# EAGLE design Wrist (EAGLE 9.5.2)
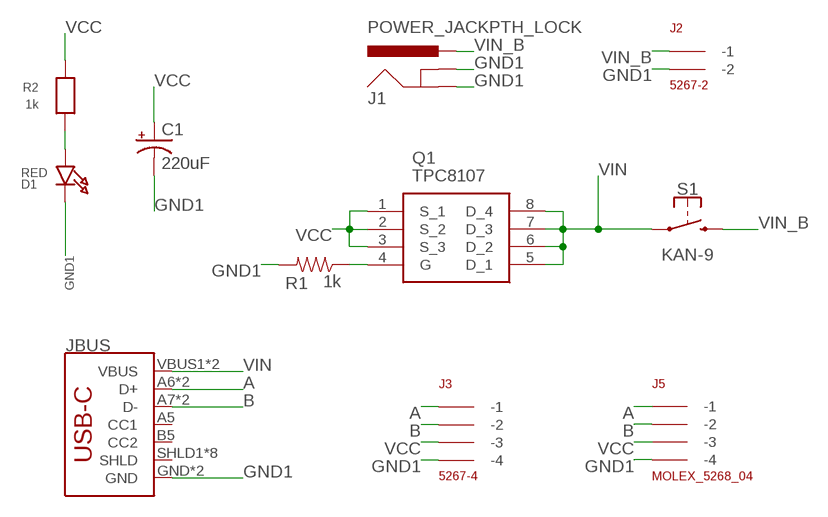
[diagram p0: schematic, sheet 1]

## Parts
C1  220uF  100UF-POLAR-25V-20%(ELEC)  [PANASONIC_D]
D1  RED  LED0603  [CHIPLED_0603]
J1  POWER_JACKPTH_LOCK  [POWER_JACK_PTH_LOCK]
J2  5267-2  [5267-2]
J3  5267-4  [5267-4]
J5  MOLEX_5268_04  [5267-4]
JBUS  USB_C16PIN  [USB-C-16P]
Q1  TPC8107  [SOIC127P600X175-8N]
R1  1k  1KOHM-0603-1/10W-1%  [0603]
R2  1k  RESISTOR0603MINI  [0603-MINI]
S1  KAN-9  [KAN-9]

## Nets
A: J3.P$1(-1) J5.P$1(-1) JBUS.A6(D+) JBUS.B6(D+)
B: J3.P$2(-2) J5.P$2(-2) JBUS.A7(D-) JBUS.B7(D-)
GND1 [POWER]: C1.- D1.C J1.GND J1.GNDBREAK J2.P$2(-2) J3.P$4(-4) J5.P$4(-4) JBUS.GND JBUS.GND2(GND) R1.2
N$6: D1.A R2.1
N$7: Q1.4(G) R1.1
VCC [POWER]: C1.+ J3.P$3(-3) J5.P$3(-3) Q1.1(S_1) Q1.2(S_2) Q1.3(S_3) R2.2
VIN [POWER]: JBUS.VBUS1(VBUS) JBUS.VBUS2(VBUS) Q1.5(D_1) Q1.6(D_2) Q1.7(D_3) Q1.8(D_4) S1.P$1
VIN_B [POWER]: J1.PWR J2.P$1(-1) S1.P$2
Unconnected: JBUS.A5(CC1) JBUS.B5(CC2) JBUS.SHLD1(SHLD) JBUS.SHLD2(SHLD) JBUS.SHLD3(SHLD) JBUS.SHLD4(SHLD) JBUS.SHLD5(SHLD) JBUS.SHLD6(SHLD) JBUS.SHLD7(SHLD) JBUS.SHLD8(SHLD)

## Library data of the parts
C1 = SparkFun-Capacitors:100UF-POLAR: 100µF polarized capacitors A capacitor is a passive two-terminal electrical component used to store electrical energy temporarily in an electric field.; PROD_ID: CAP-12547; VALUE: 100uF
D1 = microbuilder:LED: LED 0603 - 0603 Surface Mount Package 2mA: Green LED - Low Power (3.9mcd, 2ma, 1.7Vf) - Digikey: 475-2709-2-ND Orange LED - Low Power (9.8mcd, 2ma, 1.8Vf) - Digikey: 475-1194-2-ND Red LED - Low Power (5mcd, 2ma, 1.8Vf) - Digikey: 475-1195-2-ND Yellow LED - Low Power (7mcd, 2ma, 1.8Vf) - Digikey: 475-1196-2-ND 5mA: Blue LED - Low Power (17mcd, 5ma, 2.9Vf) - Digikey: LNJ937W8CRACT-ND 0805 - 0805 Surface Mount Package 2mA: Red LED (8.8mcd, 2mA, 1.8Vf, Clear) - Low Power [Digikey: 475-2510-1-ND] Green LED (5mcd, 2mA, 1.8Vf, Clear) - Low Power [Digikey: 475-2730-1-ND] Yellow LED (11.3mcd, 2mA, 1.8Vf, Clear) - Low Power [Digikey: 475-2555-1-ND] 20mA: Red LED (104mcd, 20mA, Diffused) - LS R976 [Digikey: 475-1278-6-ND] Red LED (12mcd, 20mA, 2.0Vf, Clear) - APT2012EC [Digikey: 754-1128-1-ND] Green LED (15mcd, 20mA, 2.2Vf, Clear) - APT2012GC [Digikey: 754-1131-1-ND] Orange LED (160mcd, 20mA, 2.1Vf, Clear) - APT2012SECK [Digikey: 754-1130-1-ND] 1206 - 1206 Surface Mount Package Green LED (26mcd, 20mA, Diffused) - LG N971 [Digikey: 475-1407-6-ND] Red LED (15mcd, 20mA, Diffused) - LH N974 [Digikey: 475-1416-6-ND]
J1 = SparkFun-Connectors:POWER_JACK: Power Jack Connector This is the standard 5.5mm barrel jack for power. The PTH is the most common, proven, reliable, footprint. The Slot footprint only works if the mill layer is transmitted to the PCB fab house so be warned. Here are the connectors we sell at SparkFun: DC Barrel Power Jack/Connector <https://www.sparkfun.com/products/119> (PRT-00119) DC Barrel Power Jack/Connector (SMD) <https://www.sparkfun.com/products/12748> (PRT-12748) DC Barrel Jack Adapter - Breadboard Compatible <https://www.sparkfun.com/products/10811> (PRT-10811) It is used on this SparkFun product (and many, many others): SparkFun RedBoard - Programmed with Arduino <https://www.sparkfun.com/products/12757> (DEV-12757) Also, if you need a mating power supply or connector, please check these out: Wall Adapter Power Supply - 9VDC 650mA <https://www.sparkfun.com/products/298> (TOL-00298) DC Barrel Jack Adapter - Male <https://www.sparkfun.com/products/10287> (PRT-10287); PROD_ID: CONN-08197; SF_ID: PRT-00119
J2 = con-molex-spox:5267-2
J3 = con-molex-spox:5267-4
J5 = customCON:MOLEX_5268_04
JBUS = SparkFun-Connectors:USB_C: USB Type C 16Pin Connector Super Speed pins not available on the 16-pin purely SMD connector so this part is best for USB 2.0 implementations. D1 and D2 are tied together enabling D+/- no matter which way the cable is plugged into the connector. The two channel configuration pins (CC1/2) are exposed. These are normally connected to ground via 5.1k resistors but can be reconfigured for high current/high power applications.; PROD_ID: CONN-14122
Q1 = TPC8107:TPC8107: MOSFET P-Channel 30V 12A 8-Pin SOIC TPC8107; ALLIED_NUMBER: 70438040; ALLIED_PRICE-STOCK: https://www.alliedelec.com/diodes-inc-dmg4413lss-13/70438040/; DESCRIPTION: MOSFET P-Channel 30V 12A SOIC8PEP Diodes Inc DMG4413LSS-13 P-channel MOSFET Transistor, 12 A, 30 V, 8-Pin SOIC; HEIGHT: 1.75mm; MANUFACTURER_NAME: Diodes Inc.; MANUFACTURER_PART_NUMBER: DMG4413LSS-13; MOUSER_PART_NUMBER: 621-DMG4413LSS-13; MOUSER_PRICE-STOCK: https://www.mouser.com/Search/Refine.aspx?Keyword=621-DMG4413LSS-13; RS_PART_NUMBER: 7514102P; RS_PRICE-STOCK: http://uk.rs-online.com/web/p/products/7514102P
R1 = SparkFun-Resistors:1KOHM: 1kΩ resistor A resistor is a passive two-terminal electrical component that implements electrical resistance as a circuit element. Resistors act to reduce current flow, and, at the same time, act to lower voltage levels within circuits. - Wikipedia; PROD_ID: RES-07856
R2 = microbuilder:RESISTOR: Resistors 0402 - 0402 Surface Mount Package 22 Ohm 1% 1/16W [Digikey: 311-22.0LRTR-ND] 33 Ohm 5% 1/16W 1.0K 5% 1/16W 1.5K 5% 1/16W 2.0K 1% 1/16W 10.0K 1% 1/16W [Digikey: 311-10.0KLRTR-ND] 10.0K 5% 1/16W [Digikey: RMCF0402JT10K0TR-ND] 12.1K 1% 1/16W [Digikey: 311-22.0LRTR-ND] 100.0K 5% 1/16W 0603 - 0603 Surface Mount Package 0 Ohm 1/10 Watt 1% Resistor 15 Ohm 1/10 Watt 1% Resistor 33 Ohm 1/10 Watt 1% Resistor 49.9 Ohm 1/10 Watt 1% Resistor 100 Ohm 1/10 Watt 1% Resistor 150 Ohm 1/10 Watt 1% Resistor 240 Ohm 1/10 Watt 1% Resistor 390 Ohm 1/10 Watt 1% Resistor 560 Ohm 1/10 Watt 1% Resistor 680 Ohm 1/10 Watt 1% Resistor 750 Ohm 1/10 Watt 1% Resistor 1.0K Ohm 1/10 Watt 1% Resistor 1.5K Ohm 1/10 Watt 1% Resistor 2.0K Ohm 1/10 Watt 1% Resistor 2.2K Ohm 1/10 Watt 1% Resistor 3.3K Ohm 1/10 Watt 1% Resistor 4.7K Ohm 1/10 Watt 1% Resistor 10.0K Ohm 1/10 Watt 1% Resistor 12.0K Ohm 1/10 Watt 1% Resistor 12.1K Ohm 1/10 Watt 1% Resistor 20.0K Ohm 1/10 Watt 1% Resistor 33.0K Ohm 1/10 Watt 1% Resistor 100.0K Ohm 1/10 Watt 1% Resistor 0805 - 0805 Surface Mount Package 0 Ohm 1/8 Watt 1% Resistor 33 Ohm 1/8 Watt 1% Resistor 100 Ohm 1/8 Watt 1% Resistor 150 Ohm 1/8 Watt 1% Resistor 200 Ohm 1/8 Watt 1% Resistor 240 Ohm 1/8 Watt 1% Resistor 330 Ohm 1/8 Watt 1% Resistor 390 Ohm 1/8 Watt 1% Resistor 470 Ohm 1/8 Watt 1% Resistor 1.0K Ohm 1/8 Watt 1% Resistor 1.5K Ohm 1/8 Watt 1% Resistor 2.0K Ohm 1/8 Watt 1% Resistor 4.7K Ohm 1/8 Watt 1% Resistor 5.1K Ohm 1/8 Watt 1% Resistor 5.6K Ohm 1/8 Watt 1% Resistor 10.0K Ohm 1/8 Watt 1% Resistor 22.0K Ohm 1/8 Watt 1% Resistor 33.0K Ohm 1/8 Watt 1% Resistor 100K Ohm 1/8 Watt 1% Resistor 1206 - 1206 Surface Mount Package 2012 - 2010 Surface Mount Package 0.11 Ohm 1/2 Watt 1% Resistor - Digikey: RHM.11UCT-ND
S1 = customSWITCH:KAN-9

## Net classes
0 SIG: width 0.254 mm, drill 0.3 mm, clearance 0.152 mm
1 POWER: width 0.305 mm, drill 0.3 mm, clearance 0.152 mm

## Board
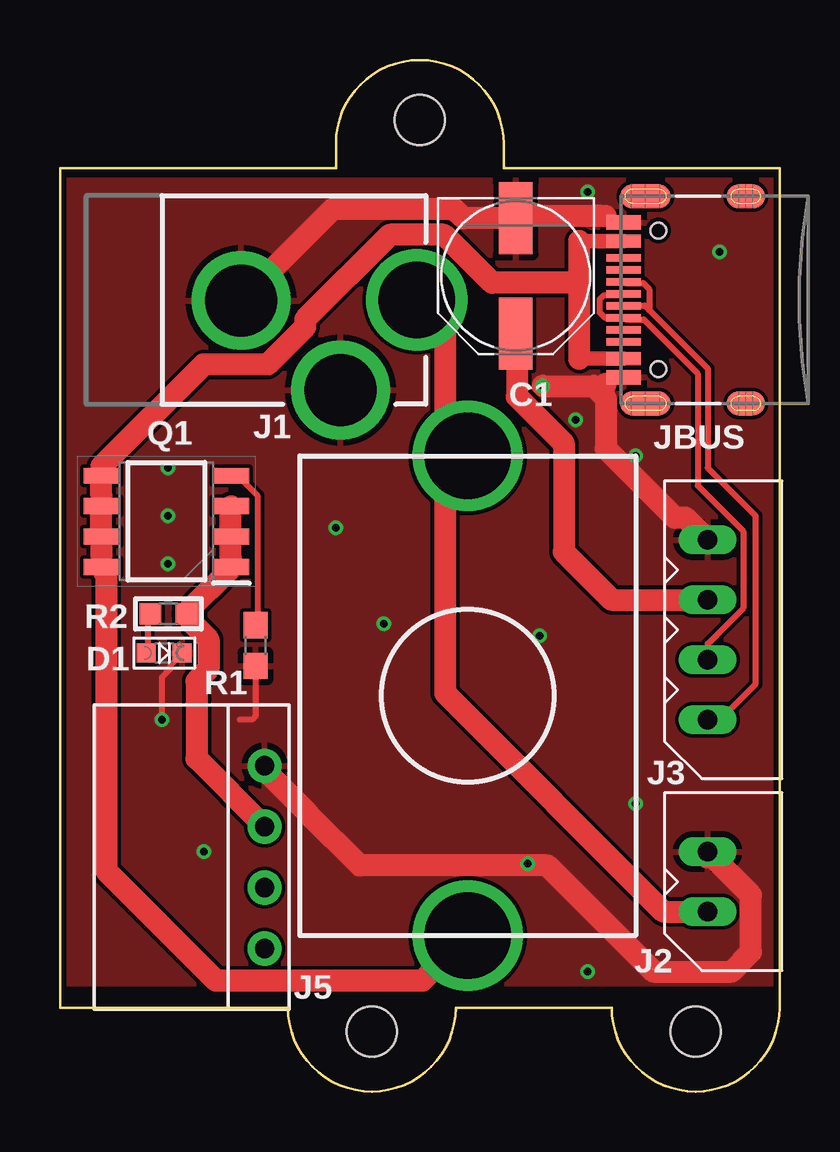
[diagram p1: board, top side]
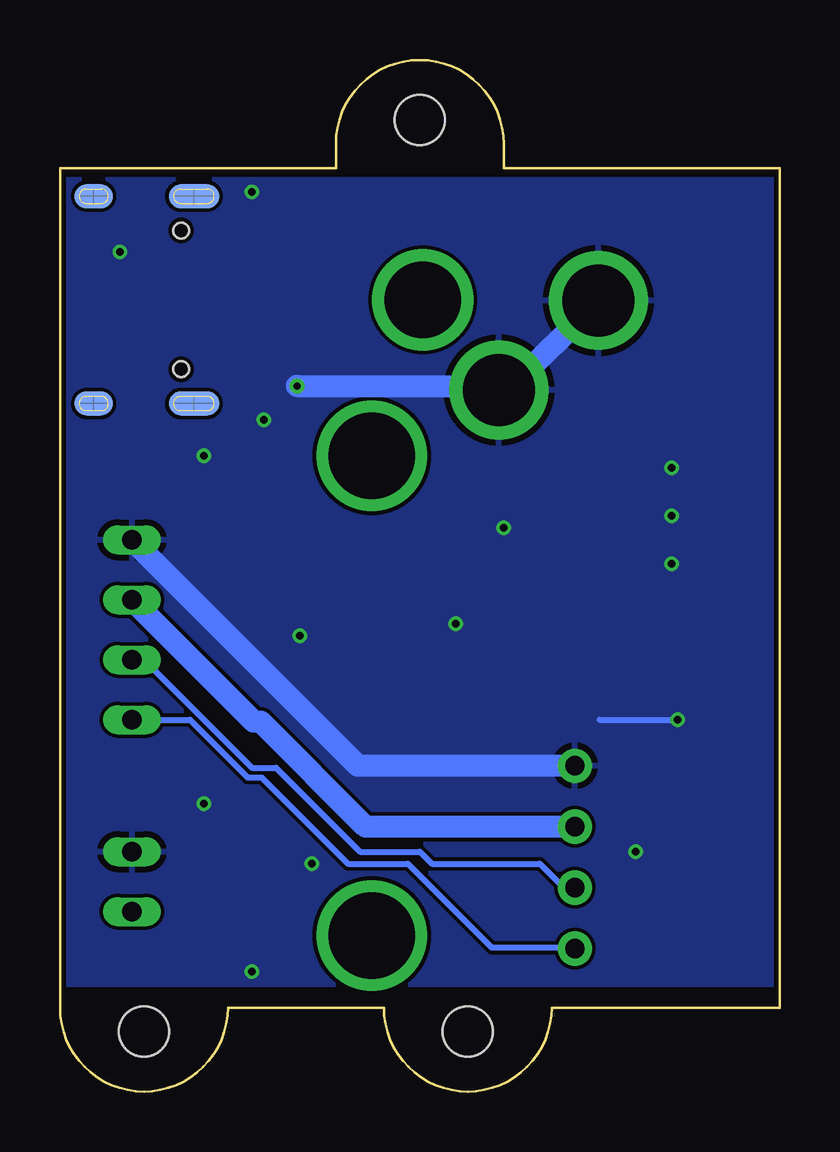
[diagram p2: board, bottom side, seen from below]

Size 30 x 43 mm. Coordinates in mm from the lower left corner, seen from the top.
Outline: 0,3.5 9.5,3.5 arc180 16.5,3.5 23,3.5 arc180 30,3.5 30,38.5 18.5,38.5 18.5,39.5 arc180 11.5,39.5 11.5,38.5 0,38.5 0,3.5
Copper layers (1*16): Top 0.035mm / dielectric 1.13mm / Bottom 0.035mm
Design rules "default *": minimum track width 6mil, minimum drill 0.3mm, track to track 6mil, track to pad 6mil, pad to pad 6mil, via to via 6mil, smd to smd 0mil, copper to edge 8mil, drill to drill 10mil, minimum pad ring 6mil, minimum via ring 6mil, stop-mask expansion 4mil, vias tented up to drill 12mil, thermal gap 10mil
Holes 2.1 mm at 13,2.5 26.5,2.5 15,40.5

### Footprints (pad centres in the part's own frame; a part is rotated, then mirrored left to right if it is on the bottom)
PANASONIC_D = smd 3 x 1.4: + 2.4,0; - -2.4,0
CHIPLED_0603 = smd 0.8 x 0.8: A 0,-0.75; C 0,0.75
POWER_JACK_PTH_LOCK = drill 2.997 pad 4.115: GND 0.025,6.557; GNDBREAK 3.762,10.7 | drill 3.2 pad 4.115: PWR 0,13.878
5267-2 = drill 0.8 long: P$1 0,0; P$2 2.5,0
5267-4 = drill 0.8 long: P$1 0,0; P$2 2.5,0; P$3 5,0; P$4 7.5,0
5267-4' = drill 0.8 pad 1.422: P$1 -2.54,-2.032; P$2 0,-2.032; P$3 2.54,-2.032; P$4 5.08,-2.032
USB-C-16P = smd 0.3 x 1.45: A5 -1.25,0; A6 -0.25,0; A7 0.25,0; A8 1.25,0; B5 1.75,0; B6 0.75,0; B7 -0.75,0; B8 -1.75,0 | smd 0.6 x 1.45: GND -3.225,0; GND2 3.225,0 | smd 1 x 2.1: SHLD1 -4.32,-0.915; SHLD2 4.32,-0.915 | smd 1 x 2.1 bottom: SHLD3 -4.32,-0.915; SHLD4 4.32,-0.915 | smd 1 x 1.6: SHLD5 -4.32,-5.095; SHLD8 4.32,-5.095 | smd 1 x 1.6 bottom: SHLD6 -4.32,-5.095; SHLD7 4.32,-5.095 | smd 0.55 x 1.45: VBUS1 -2.45,0; VBUS2 2.45,0 | hole 0.65: -2.89,-1.445; 2.89,-1.445
SOIC127P600X175-8N = smd 1.5 x 0.65: 1 -2.7,1.905; 2 -2.7,0.635; 3 -2.7,-0.635; 4 -2.7,-1.905; 5 2.7,-1.905; 6 2.7,-0.635; 7 2.7,0.635; 8 2.7,1.905
0603 = smd 1.1 x 1: 1 -0.85,0; 2 0.85,0
0603-MINI = smd 0.9 x 0.9: 1 -0.75,0; 2 0.75,0
KAN-9 = drill 3.6: P$1 10,0; P$2 -10,0

### Placement (x,y rotation side)
C1  19,34 270 top
D1  4.34,18.28 270 top
J1  1,33 270 top
J2  27,7.5 90 top
J3  27,15.5 90 top
J5  MOLEX_5268_04  [5267-4']  6.5,8.5 90 top
JBUS  23.5,33 90 top
Q1  4.44,23.77 180 top
R1  8.15,18.59 270 top
R2  4.52,19.91 0 top
S1  17,16.5 270 top

### Tracks (layer width: path | path; a pad name or v marks a point on that pad's centre or on a via)
A
  Top 0.254: JBUS.A6 23.57,32.76 24.38,32.76 24.57,32.57 | J3.P$1 27.5,15.5 29,17 29,24 27,26 27,30.14 24.57,32.57 | JBUS.B6 23.55,33.7 24.32,33.7 24.57,33.45 24.57,32.57
  Bottom 0.254: J5.P$1 9,6 12,6 15.5,9.5 18,9.5 21.59,13.09 22.17,13.09 24.57,15.5 J3.P$1
B
  Top 0.254: 23.57,32.25 JBUS.B7 | J3.P$2 27,18.66 28.48,20.14 28.48,23.36 26.59,25.25 26.59,29.93 24.34,32.18 23.57,32.18 JBUS.B7 | JBUS.A7 23.43,33.18 22.66,33.18 22.5,33.02 22.5,32.48 22.73,32.25 JBUS.B7
  Bottom 0.254: J3.P$2 26.5,18 22,13.5 21,13.5 17.5,10 15,10 14.5,9.5 10,9.5 9,8.5 J5.P$2
GND1  (via drill 0.3)
  Top 0.254: R1.2 8.15,15.65 8,15.5 7.5,15.5 | v4.25,15.5 4.25,17.27 4.61,17.63 4.61,17.79 D1.C
  Top 0.61: JBUS.GND2 23.02,36.23 22.75,36.5 | JBUS.GND 23.02,29.77 22.75,29.5
  Top 0.914: 27,9.75 J2.P$2 28.81,8.19 28.81,5.81 28,5 24.75,5 20.33,9.42 12.49,9.42 10.35,11.55 10.35,11.59 8.53,13.41 J5.P$4 | 22.75,29.5 22.66,29.2 22.25,29.41 | 22.75,36.5 22.45,36.52 19.03,36.52 C1.- | 18.58,36.52 C1.- | v20.12,29.41 22.25,29.41 | C1.- 16.83,36.4 16.45,36.78 11.37,36.78 J1.GND | 22.25,29.41 22.75,28.9 22.75,26.8 25.63,23.92 26.08,23.92 J3.P$4
  Bottom 0.254: 7.5,15.5 v4.25,15.5
  Bottom 0.914: v20.12,29.41 11.87,29.41 J1.GNDBREAK 11.29,29.24 J1.GND | J5.P$4 17.58,13.58 J3.P$4
  other vias: 19.5,9.5 22,5 24,12 6,10 13.5,19.5 11.5,23.5 4.5,24 22,37.5 27.5,35 21.5,28 20,19 24,26.5 4.5,22 4.5,26
  pour Top: -2,38 32,38 32,4.5 -2,4.5
  pour Bottom: -4,38 34,38 34,4.5 -4,4.5
N$6
  Top 0.254: D1.A 3.66,18.33 3.66,19.76 3.76,19.86 R2.1
N$7
  Top 0.254: R1.1 8.23,19.45 8.23,24.84 7.42,25.65 7.21,25.65 Q1.4
VCC
  Top 0.914: 7.11,23.11 7.11,22.3 Q1.1 7.11,21.79 5.28,19.96 R2.2 5.49,19.55 6.2,18.84 6.2,17.62 5.69,17.11 5.69,13.88 J5.P$3 | 7.11,23.11 Q1.2 | 7.11,23.11 7.11,24.33 Q1.3 | 19,30.63 C1.+ 19.05,31.55 19.05,28.97 21,27.02 21,22.5 23,20.5 J3.P$3
  Bottom 0.914: J3.P$3 21.91,15.41 21.62,15.41 17.25,11.04 J5.P$3
VIN
  Top 0.305: 21.65,33.27 21.62,33.27 21.45,33.71
  Top 0.61: JBUS.VBUS2 21.65,35.45 | JBUS.VBUS1 21.65,30.55
  Top 0.914: 21.65,30.55 21.65,33.27 21.65,35.45 | 1.73,23.11 1.73,21.89 | 1.73,21.89 Q1.8 | 1.73,23.11 Q1.7 | 1.73,23.11 1.73,24.33 Q1.6 1.73,24.84 1.73,25.65 | 1.73,25.65 Q1.5 | 1.73,25.65 1.73,26.05 5.98,30.31 8.66,30.31 10.22,31.87 10.22,32.19 13.75,35.72 16,35.72 18.01,33.71 21.45,33.71 | 16.95,6.45 S1.P$1 15.12,4.62 6.5,4.62 1.93,9.19 1.93,21.48 1.73,21.89
VIN_B
  Top 0.914: J1.PWR 16.05,31.82 16.05,26.5 | 16.05,26.5 16.05,16.61 25.16,7.5 J2.P$1 | 16.05,26.5 S1.P$2